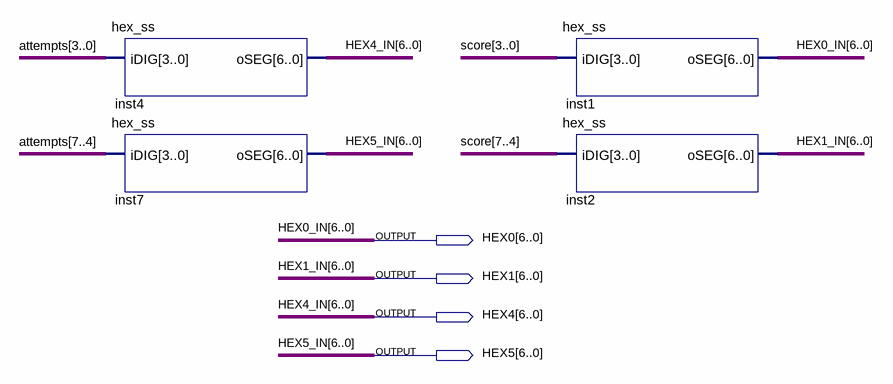
[diagram p0: schematic sheet]
// Quartus schematic game_and_score_test.bdf as structural Verilog: 4 symbols, 4 pins
module game_and_score_test (
  output [6:0] HEX0,
  output [6:0] HEX1,
  output [6:0] HEX4,
  output [6:0] HEX5
);

  wire [7:0] attempts, score;

  hex_ss inst4 (.iDIG(attempts[3:0]), .oSEG(HEX4));
  hex_ss inst7 (.iDIG(attempts[7:4]), .oSEG(HEX5));
  hex_ss inst1 (.iDIG(score[3:0]), .oSEG(HEX0));
  hex_ss inst2 (.iDIG(score[7:4]), .oSEG(HEX1));

  // Other names for the same wires on the sheet: HEX0_IN[6:0] = HEX0; HEX1_IN[6:0] = HEX1; HEX4_IN[6:0] = HEX4;
  //   HEX5_IN[6:0] = HEX5
endmodule
